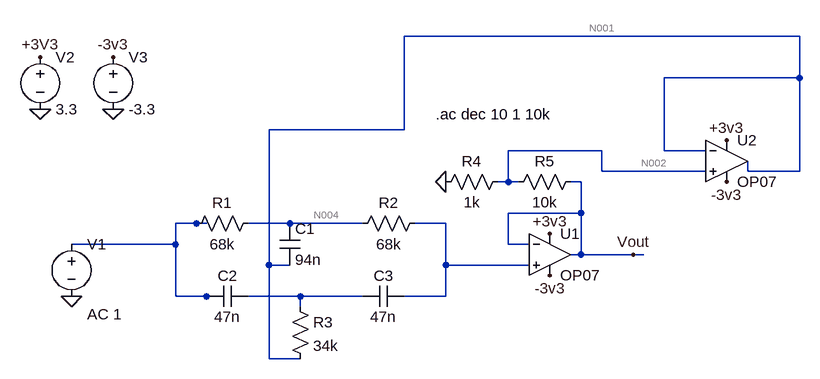
[diagram p0: schematic EMG_notch_filter_test.asc]
EMG_notch_filter_test.asc, the LTspice schematic file:
Version 4.1
SHEET 1 1012 680
WIRE 992 -192 384 -192
WIRE 992 -128 992 -192
WIRE 992 -128 784 -128
WIRE 384 -48 384 -192
WIRE 384 -48 176 -48
WIRE 688 -16 544 -16
WIRE 784 -16 784 -128
WIRE 848 -16 784 -16
WIRE 688 16 688 -16
WIRE 848 16 688 16
WIRE 912 16 912 0
WIRE 992 16 992 -128
WIRE 992 16 912 16
WIRE 544 32 544 -16
WIRE 544 32 528 32
WIRE 560 32 544 32
WIRE 656 32 640 32
WIRE 656 80 656 32
WIRE 656 80 544 80
WIRE 64 96 32 96
WIRE 80 96 64 96
WIRE 208 96 144 96
WIRE 320 96 208 96
WIRE 448 96 400 96
WIRE 32 128 32 96
WIRE 32 128 -128 128
WIRE 544 128 544 80
WIRE 576 128 544 128
WIRE 656 144 656 80
WIRE 656 144 640 144
WIRE 736 144 656 144
WIRE 752 144 736 144
WIRE 176 160 176 -48
WIRE 208 160 176 160
WIRE 448 160 448 96
WIRE 576 160 448 160
WIRE 32 208 32 128
WIRE 80 208 32 208
WIRE 96 208 80 208
WIRE 224 208 144 208
WIRE 320 208 224 208
WIRE 448 208 448 160
WIRE 448 208 384 208
WIRE 224 224 224 208
WIRE 176 304 176 160
WIRE 224 304 176 304
FLAG -128 208 0
FLAG -176 -80 0
FLAG -64 -80 0
FLAG -176 -160 +3V3
FLAG -64 -160 -3v3
FLAG 736 144 Vout
FLAG 448 32 0
FLAG 608 112 +3v3
FLAG 608 176 -3v3
FLAG 880 -32 +3v3
FLAG 880 32 -3v3
SYMBOL voltage -128 112 R0
WINDOW 123 24 124 Left 2
WINDOW 39 0 0 Left 0
SYMATTR Value2 AC 1
SYMATTR InstName V1
SYMATTR Value ""
SYMBOL voltage -176 -176 R0
WINDOW 123 0 0 Left 0
WINDOW 39 0 0 Left 0
SYMATTR InstName V2
SYMATTR Value 3.3
SYMBOL voltage -64 -176 R0
WINDOW 123 0 0 Left 0
WINDOW 39 0 0 Left 0
SYMATTR InstName V3
SYMATTR Value -3.3
SYMBOL cap 192 96 R0
SYMATTR InstName C1
SYMATTR Value 94n
SYMBOL res 160 80 R90
WINDOW 0 0 56 VBottom 2
WINDOW 3 32 56 VTop 2
SYMATTR InstName R1
SYMATTR Value 68k
SYMBOL res 416 80 R90
WINDOW 0 0 56 VBottom 2
WINDOW 3 32 56 VTop 2
SYMATTR InstName R2
SYMATTR Value 68k
SYMBOL cap 144 192 R90
WINDOW 0 0 32 VBottom 2
WINDOW 3 32 32 VTop 2
SYMATTR InstName C2
SYMATTR Value 47n
SYMBOL cap 384 192 R90
WINDOW 0 0 32 VBottom 2
WINDOW 3 32 32 VTop 2
SYMATTR InstName C3
SYMATTR Value 47n
SYMBOL res 208 208 R0
SYMATTR InstName R3
SYMATTR Value 34k
SYMBOL OpAmps\\OP07 608 80 R0
SYMATTR InstName U1
SYMBOL res 544 16 R90
WINDOW 0 0 56 VBottom 2
WINDOW 3 32 56 VTop 2
SYMATTR InstName R4
SYMATTR Value 1k
SYMBOL res 656 16 R90
WINDOW 0 0 56 VBottom 2
WINDOW 3 32 56 VTop 2
SYMATTR InstName R5
SYMATTR Value 10k
SYMBOL OpAmps\\OP07 880 -64 R0
SYMATTR InstName U2
TEXT 432 -72 Left 2 !.ac dec 10 1 10k

The netlist it stands for:
* EMG_notch_filter_test.asc
V1 N003 0 AC 1
V2 +3V3 0 3.3
V3 -3v3 0 -3.3
C1 N004 N001 94n
R1 N004 N003 68k
R2 N005 N004 68k
C2 N006 N003 47n
C3 N005 N006 47n
R3 N006 N001 34k
X§U1 N005 Vout +3V3 -3v3 Vout LT1001  ; OP07, pins In+ In- V+ V- OUT
R4 N002 0 1k
R5 Vout N002 10k
X§U2 N002 N001 +3V3 -3v3 N001 LT1001  ; OP07, pins In+ In- V+ V- OUT
.ac dec 10 1 10k
.lib LTC.lib
.backanno
.end

* Results of the author's LTspice run, read from the files saved beside the schematic
* Operating Point, zero values left out:
*   V(+3v3) = 3.3 V
*   V(-3v3) = -3.3 V
*   I(V3) = 4.5 mA
*   I(V2) = -4.5 mA
*   Ix(u2:3) = 2.25 mA
*   Ix(u2:4) = -2.25 mA
*   Ix(u1:3) = 2.25 mA
*   Ix(u1:4) = -2.25 mA
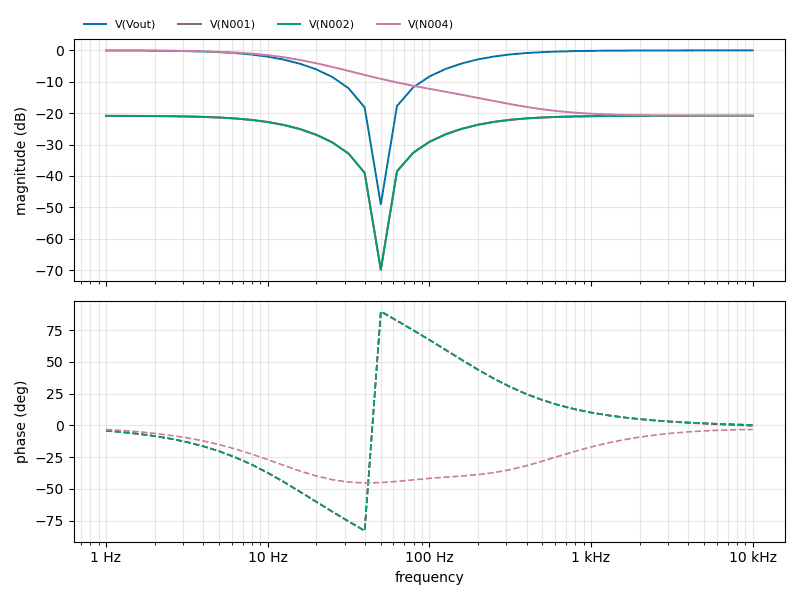
[diagram p1: AC Analysis of EMG_notch_filter_test.asc, plotted from the saved traces]
* AC Analysis, 1 run:
*   V(Vout): -0.02 dB at 1 Hz, -0.00 dB at 10 kHz, peak -0.00 dB at 10 kHz, 3 dB below the peak at 194.6 Hz
*   V(N001): -20.85 dB at 1 Hz, -20.83 dB at 10 kHz, peak -20.83 dB at 10 kHz, 3 dB below the peak at 194.6 Hz
*   V(N002): -20.85 dB at 1 Hz, -20.83 dB at 10 kHz, peak -20.83 dB at 10 kHz, 3 dB below the peak at 194.6 Hz
*   V(N004): -0.02 dB at 1 Hz, -20.81 dB at 10 kHz, peak -0.02 dB at 1 Hz, 3 dB below the peak at 15.79 Hz